# Altium schematic sheet IsolationOut.SchDoc
size A
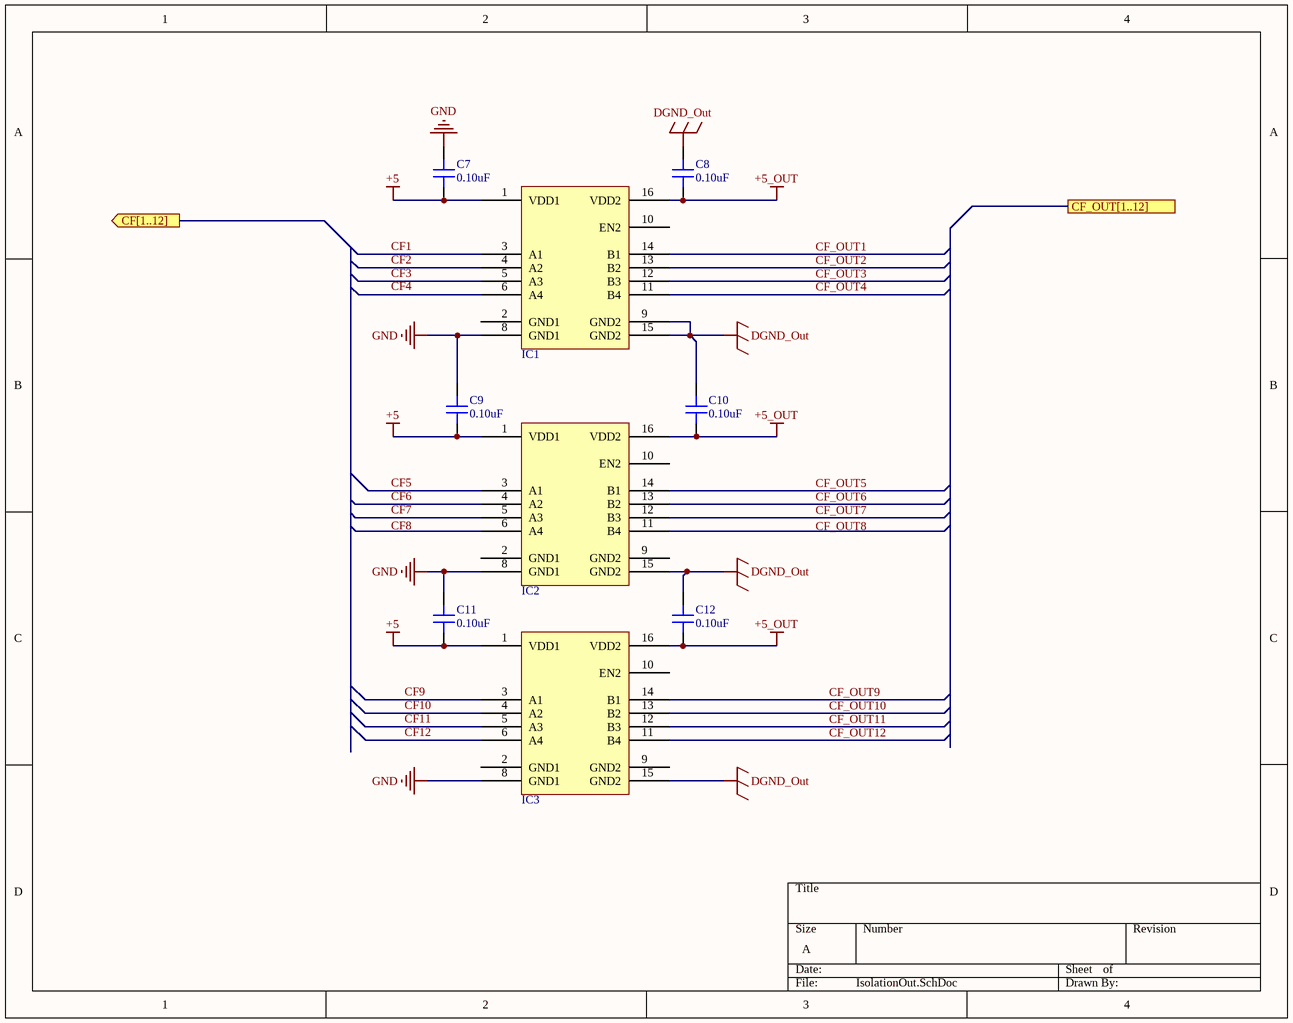
[diagram p0: IsolationOut.SchDoc]

## Parts
C7  0.10uF  [CAP 0402/1005]
C8  0.10uF  [CAP 0402/1005]
C9  0.10uF  [CAP 0402/1005]
C10  0.10uF  [CAP 0402/1005]
C11  0.10uF  [CAP 0402/1005]
C12  0.10uF  [CAP 0402/1005]
IC1  SI8640BD-B-IS  [SI LABS SOIC-16 WIDE]  (value not drawn)
IC2  SI8640BD-B-IS  [SI LABS SOIC-16 WIDE]  (value not drawn)
IC3  SI8640BD-B-IS  [SI LABS SOIC-16 WIDE]  (value not drawn)

## Ports
CF[1..12] (out), CF_OUT[1..12]

## Nets
+5: C7.1 C9.1 C11.1 IC1.1(VDD1) IC2.1(VDD1) IC3.1(VDD1)
+5_OUT: C8.1 C10.1 C12.1 IC1.16(VDD2) IC2.16(VDD2) IC3.16(VDD2)
DGND_Out: C8.2 C10.2 C12.2 IC1.9(GND2) IC1.15(GND2) IC2.15(GND2) IC3.15(GND2)
GND: C7.2 C9.2 C11.2 IC1.8(GND1) IC2.8(GND1) IC3.8(GND1)
CF1: IC1.3(A1)
CF2: IC1.4(A2)
CF3: IC1.5(A3)
CF4: IC1.6(A4)
CF5: IC2.3(A1)
CF6: IC2.4(A2)
CF7: IC2.5(A3)
CF9: IC3.3(A1)
CF10: IC3.4(A2)
CF11: IC3.5(A3)
CF12: IC3.6(A4)
CF_OUT1: IC1.14(B1)
CF_OUT2: IC1.13(B2)
CF_OUT3: IC1.12(B3)
CF_OUT4: IC1.11(B4)
CF_OUT5: IC2.14(B1)
CF_OUT6: IC2.13(B2)
CF_OUT7: IC2.12(B3)
CF_OUT9: IC3.14(B1)
CF_OUT10: IC3.13(B2)
CF_OUT11: IC3.12(B3)
CF_OUT12: IC3.11(B4)

Not connected (* = marked no-connect by the designer): IC1 2(GND1) 10(EN2); IC2 2(GND1) 6(A4) 9(GND2) 10(EN2) 11(B4); IC3 2(GND1) 9(GND2) 10(EN2)

## Notes on the sheet
- Labels drawn without touching a wire or pin: CF8, CF_OUT8

## Library data of the parts
C7-C12 = GRM155R71C104JA88D: CAP CER 0.1UF 16V X7R 0402; Manufacturer: Murata Electronics North America; TemperatureRange: -55C ~ 125C; Tolerance: 5%; Value: 0.10uF; Part Number: GRM155R71C104JA88D; PartId: 12366; Supplier 1: Digi-Key; Supplier Part Number 1: 490-6327-2-ND; ComponentLink1Description: Datasheet; ComponentLink1URL: http://www.murata.com/~/media/webrenewal/support/library/catalog/products/capacitor/mlcc/c02e.pdf; ComponentLink2Description: Digi-Key Listing; ComponentLink2URL: https://www.digikey.com/product-detail/en/murata-electronics-north-america/GRM155R71C104JA88D/490-6327-2-ND/2610891; TemperatureCoefficient: X7R; Voltage: 16V; Price: 0.0046; Device Package: 0402 (1005 Metric)
IC1-IC3 = SI8640BD-B-IS: DGTL ISO 5KV 4CH GEN PURP 16SOIC; Manufacturer: Silicon Labs; Isolated Power: No; Number of Channels: 4; Inputs - Side 1/Side2: 4/0; Channel Type: Unidirectional; Voltage - Isolation: 5000Vrms; Common Mode Transient Immunity (Min): 35kV/us; Data Rate: 150Mbps; Propagation Delay tpLH/tpHL (Max): 13ns, 13ns; Pulse Width Distortion (Max): 4.5ns; Rise / Fall Time (Typ): 2.5ns, 2.5ns; Voltage - Supply: 2.5 V ~ 5.5 V; Part Number: SI8640BD-B-IS; PartId: 14404; Supplier 1: Digi-Key; Supplier Part Number 1: 336-2083-5-ND; ComponentLink1Description: Datasheet; ComponentLink1URL: http://www.silabs.com/Support%20Documents/TechnicalDocs/Si864x.pdf; ComponentLink2Description: Digi-Key Listing; ComponentLink2URL: https://www.digikey.com/product-detail/en/silicon-labs/SI8640BD-B-IS/336-2083-5-ND/2623331; Price: 5.01; Type: General Purpose; Device Package: 16-SOIC (0.295", 7.50mm Width); Operating Temperature: -40C ~ 125C; Technology: Capacitive Coupling